# Altium schematic sheet HIL_Header.SchDoc
size 420 x 297 mm; SheetNumber: 5; SheetTotal: 5
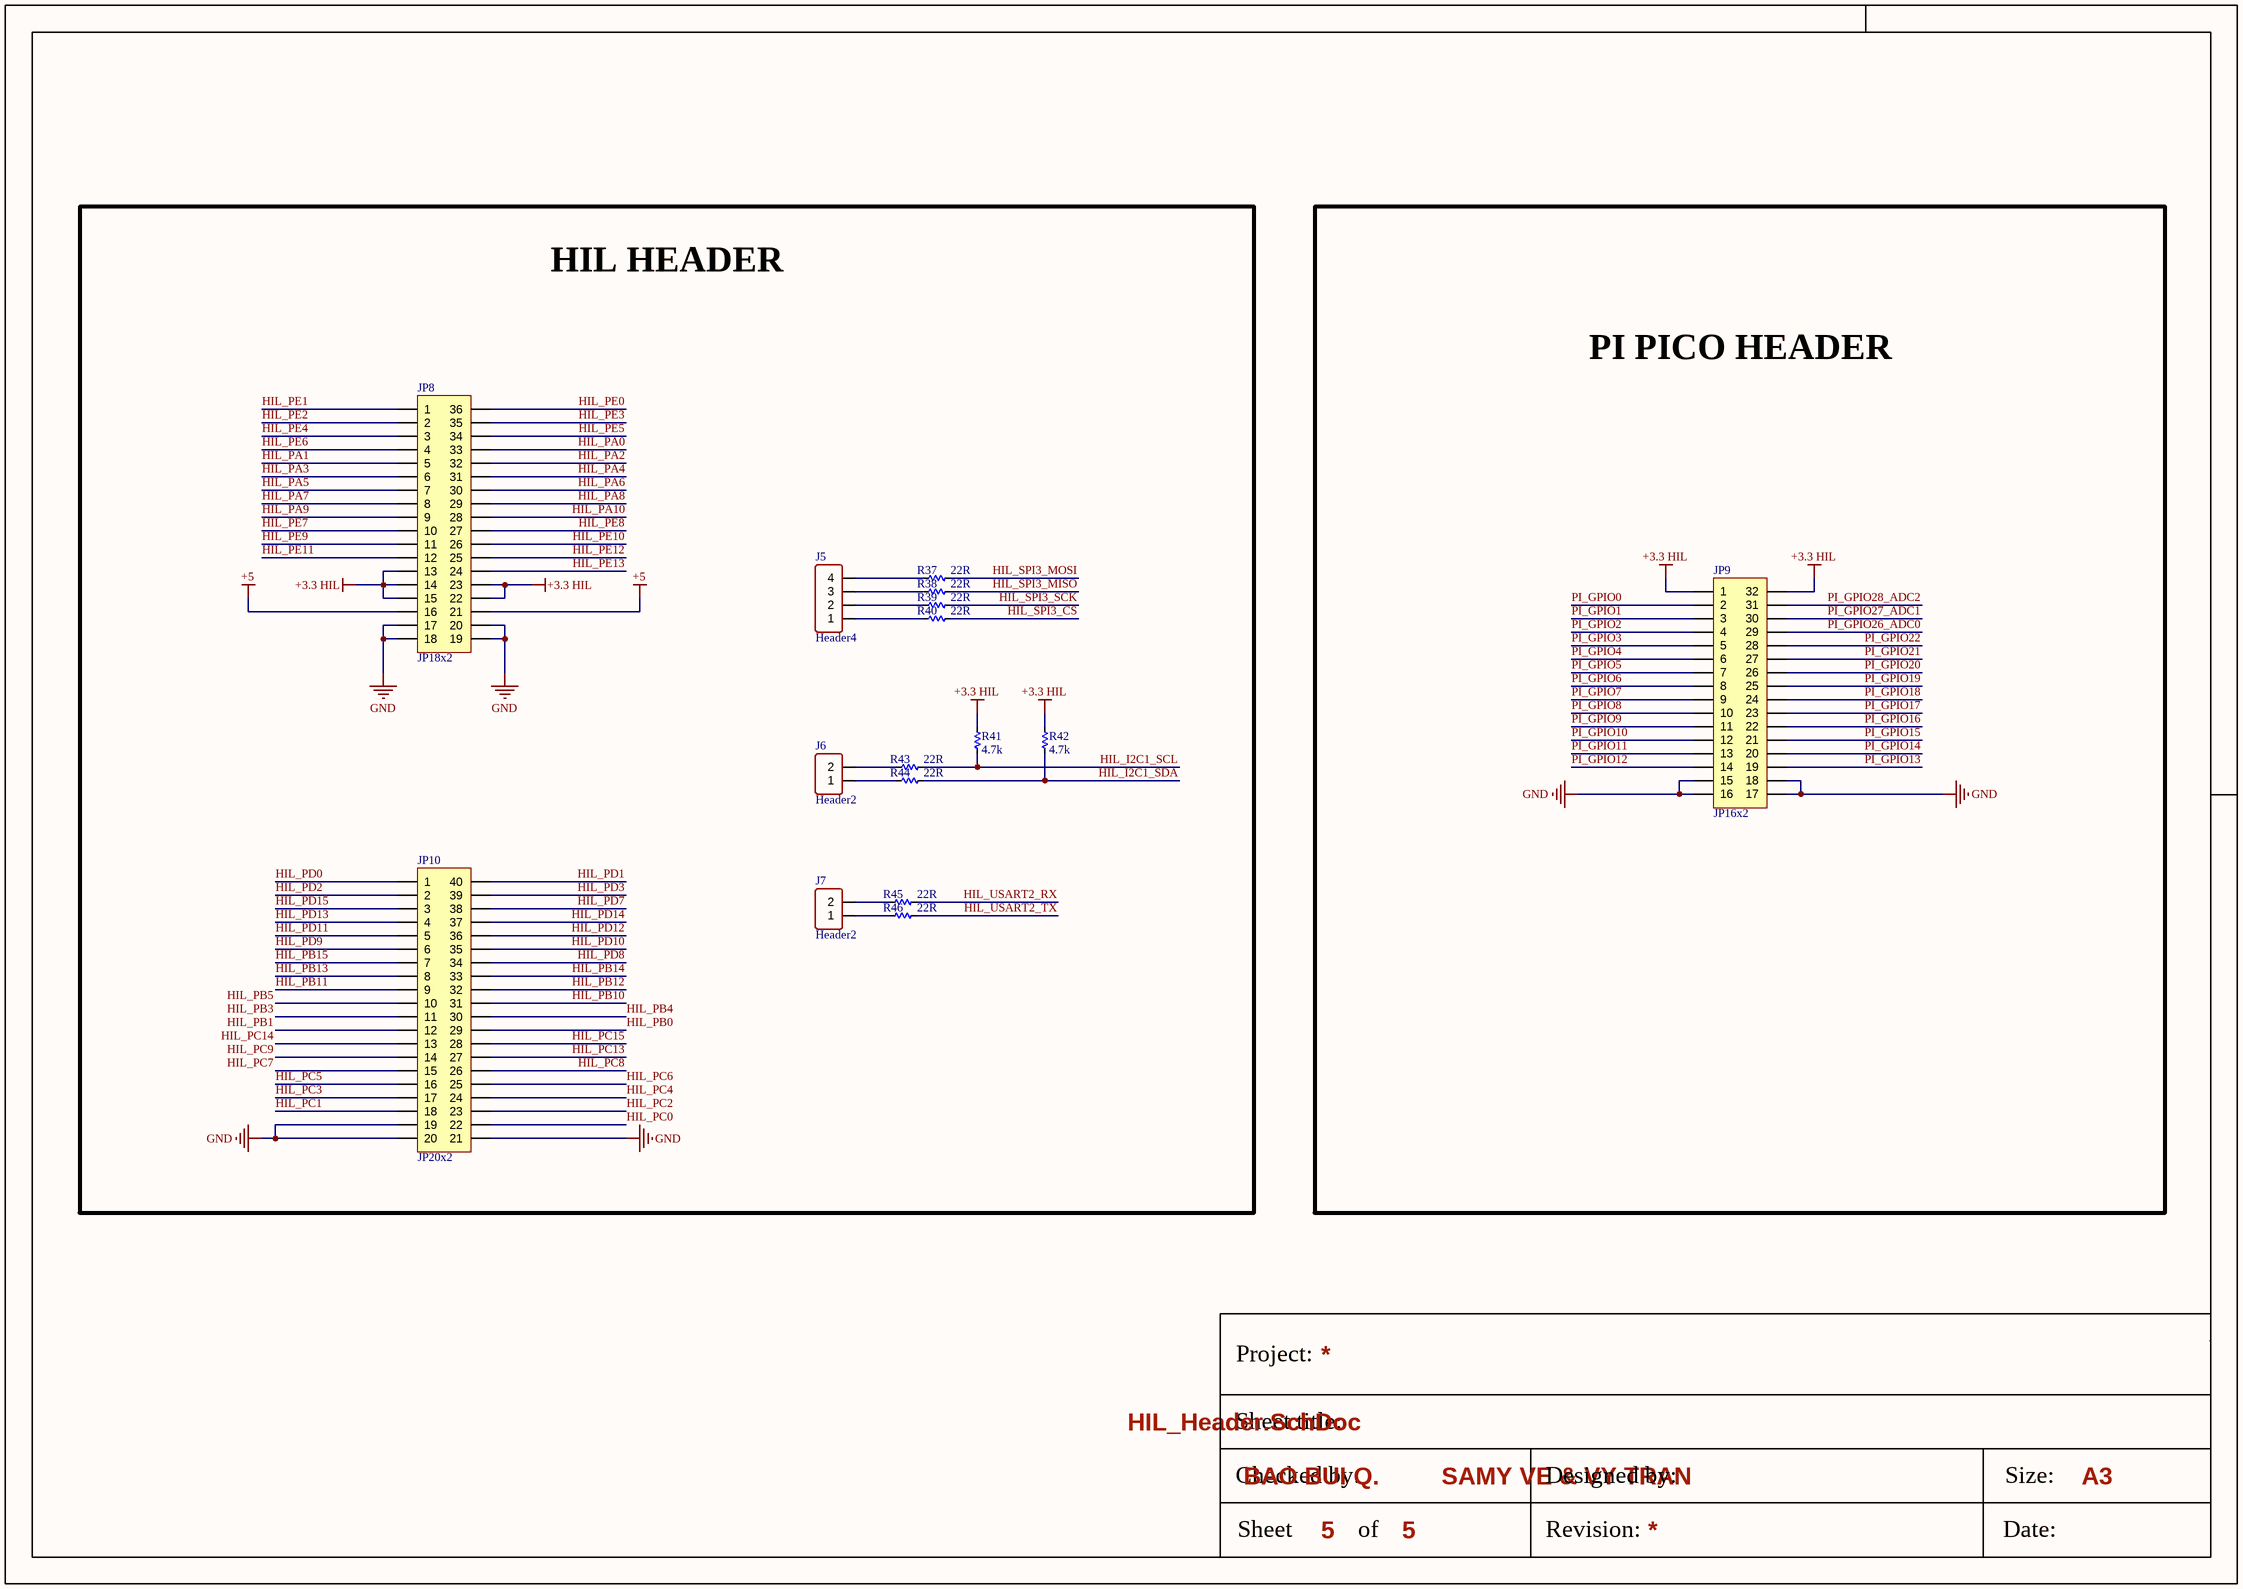
[diagram p0: HIL_Header.SchDoc]

## Parts
J5  Header4  [XH2.54-4-DIP]
J6  Header2  [XH2.54-2-DIP]
J7  Header2  [XH2.54-2-DIP]
JP8  JP18x2  [JP18-D2T]
JP9  JP16x2  [JP16-D2T]
JP10  JP20x2  [JP20-D2T]
R37  22R  [RES-SMD-0603]
R38  22R  [RES-SMD-0603]
R39  22R  [RES-SMD-0603]
R40  22R  [RES-SMD-0603]
R41  4.7k  [RES-SMD-0603]
R42  4.7k  [RES-SMD-0603]
R43  22R  [RES-SMD-0603]
R44  22R  [RES-SMD-0603]
R45  22R  [RES-SMD-0603]
R46  22R  [RES-SMD-0603]

## Blocks framed on the sheet
HIL HEADER: J5-J7 JP8 JP10 R37-R46
PI PICO HEADER: JP9

## Nets
+3.3 HIL: JP8.13 JP8.14 JP8.15 JP8.22 JP8.23 JP9.1 JP9.32 R41.1 R42.1
+5: JP8.16 JP8.21
GND: JP8.17 JP8.18 JP8.19 JP8.20 JP9.15 JP9.16 JP9.17 JP9.18 JP10.19 JP10.20 JP10.21
HIL_I2C1_SCL: R41.2 R43.1
HIL_I2C1_SDA: R42.2 R44.1
HIL_PA0: JP8.33
HIL_PA1: JP8.5
HIL_PA2: JP8.32
HIL_PA3: JP8.6
HIL_PA4: JP8.31
HIL_PA5: JP8.7
HIL_PA6: JP8.30
HIL_PA7: JP8.8
HIL_PA8: JP8.29
HIL_PA9: JP8.9
HIL_PA10: JP8.28
HIL_PB0: JP10.29
HIL_PB1: JP10.12
HIL_PB3: JP10.11
HIL_PB4: JP10.30
HIL_PB5: JP10.10
HIL_PB10: JP10.31
HIL_PB11: JP10.9
HIL_PB12: JP10.32
HIL_PB13: JP10.8
HIL_PB14: JP10.33
HIL_PB15: JP10.7
HIL_PC0: JP10.22
HIL_PC1: JP10.18
HIL_PC2: JP10.23
HIL_PC3: JP10.17
HIL_PC4: JP10.24
HIL_PC5: JP10.16
HIL_PC6: JP10.25
HIL_PC7: JP10.15
HIL_PC8: JP10.26
HIL_PC9: JP10.14
HIL_PC13: JP10.27
HIL_PC14: JP10.13
HIL_PC15: JP10.28
HIL_PD0: JP10.1
HIL_PD1: JP10.40
HIL_PD2: JP10.2
HIL_PD3: JP10.39
HIL_PD7: JP10.38
HIL_PD8: JP10.34
HIL_PD9: JP10.6
HIL_PD10: JP10.35
HIL_PD11: JP10.5
HIL_PD12: JP10.36
HIL_PD13: JP10.4
HIL_PD14: JP10.37
HIL_PD15: JP10.3
HIL_PE0: JP8.36
HIL_PE1: JP8.1
HIL_PE2: JP8.2
HIL_PE3: JP8.35
HIL_PE4: JP8.3
HIL_PE5: JP8.34
HIL_PE6: JP8.4
HIL_PE7: JP8.10
HIL_PE8: JP8.27
HIL_PE9: JP8.11
HIL_PE10: JP8.26
HIL_PE11: JP8.12
HIL_PE12: JP8.25
HIL_PE13: JP8.24
HIL_SPI3_CS: R40.1
HIL_SPI3_MISO: R38.1
HIL_SPI3_MOSI: R37.1
HIL_SPI3_SCK: R39.1
HIL_USART2_RX: R45.1
HIL_USART2_TX: R46.1
PI_GPIO0: JP9.2
PI_GPIO1: JP9.3
PI_GPIO2: JP9.4
PI_GPIO3: JP9.5
PI_GPIO4: JP9.6
PI_GPIO5: JP9.7
PI_GPIO6: JP9.8
PI_GPIO7: JP9.9
PI_GPIO8: JP9.10
PI_GPIO9: JP9.11
PI_GPIO10: JP9.12
PI_GPIO11: JP9.13
PI_GPIO12: JP9.14
PI_GPIO13: JP9.19
PI_GPIO14: JP9.20
PI_GPIO15: JP9.21
PI_GPIO16: JP9.22
PI_GPIO17: JP9.23
PI_GPIO18: JP9.24
PI_GPIO19: JP9.25
PI_GPIO20: JP9.26
PI_GPIO21: JP9.27
PI_GPIO22: JP9.28
PI_GPIO26_ADC0: JP9.29
PI_GPIO27_ADC1: JP9.30
PI_GPIO28_ADC2: JP9.31
NetJ5_1: J5.1 R40.2
NetJ5_2: J5.2 R39.2
NetJ5_3: J5.3 R38.2
NetJ5_4: J5.4 R37.2
NetJ6_1: J6.1 R44.2
NetJ6_2: J6.2 R43.2
NetJ7_1: J7.1 R46.2
NetJ7_2: J7.2 R45.2

## Notes on the sheet
- Project:
- Sheet title:
- BAO BUI Q.
- SAMY VE & VY TRAN
- A3
- Sheet
- Checked by:
- of
- Revision:
- Designed by:
- Size:
- Date:

## Library data of the parts
J5 = Header4: Connector 4; Manufacturer: W¨¹rth Elektronik eiSos GmbH; partNo: 613002143121; ComponentLink1 Description: Manufacturer; ComponentLink2 Description: Datasheet; NoPins: 02; Created Date: 29 March 2013; ComponentLink1URL: http://www.we-online.com; ComponentLink2URL: http://katalog.we-online.de/em/datasheet/6130xx143121.pdf; Created by: Karrer Zheng
J6 J7 = Header2: Connector 2; Manufacturer: W¨¹rth Elektronik eiSos GmbH; partNo: 613002143121; ComponentLink1 Description: Manufacturer; ComponentLink2 Description: Datasheet; NoPins: 02; Created Date: 29 March 2013; ComponentLink1URL: http://www.we-online.com; ComponentLink2URL: http://katalog.we-online.de/em/datasheet/6130xx143121.pdf; Created by: Karrer Zheng
JP8 = JP18x2: WR-PHD 2.54 mm Dual Socket Header; Manufacturer: W¨¹rth Elektronik eiSos GmbH; partNo: 61303621821; ComponentLink1 Description: Manufacturer; ComponentLink2 Description: Datasheet; NoPins: 36; Created Date: 29 March 2013; ComponentLink1URL: http://www.we-online.com; ComponentLink2URL: http://katalog.we-online.de/em/datasheet/6130xx21821.pdf; Created by: Karrer Zheng
JP9 = JP16x2: WR-PHD 2.54 mm Dual Socket Header; Manufacturer: W¨¹rth Elektronik eiSos GmbH; partNo: 61303221821; ComponentLink1 Description: Manufacturer; ComponentLink2 Description: Datasheet; NoPins: 32; Created Date: 29 March 2013; ComponentLink1URL: http://www.we-online.com; ComponentLink2URL: http://katalog.we-online.de/em/datasheet/6130xx21821.pdf; Created by: Karrer Zheng
JP10 = JP20x2: WR-PHD 2.54 mm Dual Socket Header; Manufacturer: W¨¹rth Elektronik eiSos GmbH; partNo: 61304021821; ComponentLink1 Description: Manufacturer; ComponentLink2 Description: Datasheet; NoPins: 40; Created Date: 29 March 2013; ComponentLink1URL: http://www.we-online.com; ComponentLink2URL: http://katalog.we-online.de/em/datasheet/6130xx21821.pdf; Created by: Karrer Zheng
R37-R46 = Res-SMD: Resistor; Manufacturer: Generic Components; Class: Passive; Published: 08/06/2000; Publisher: Altium Hobart Technology Centre